# EAGLE design VGA32_V3 (EAGLE 6.3)
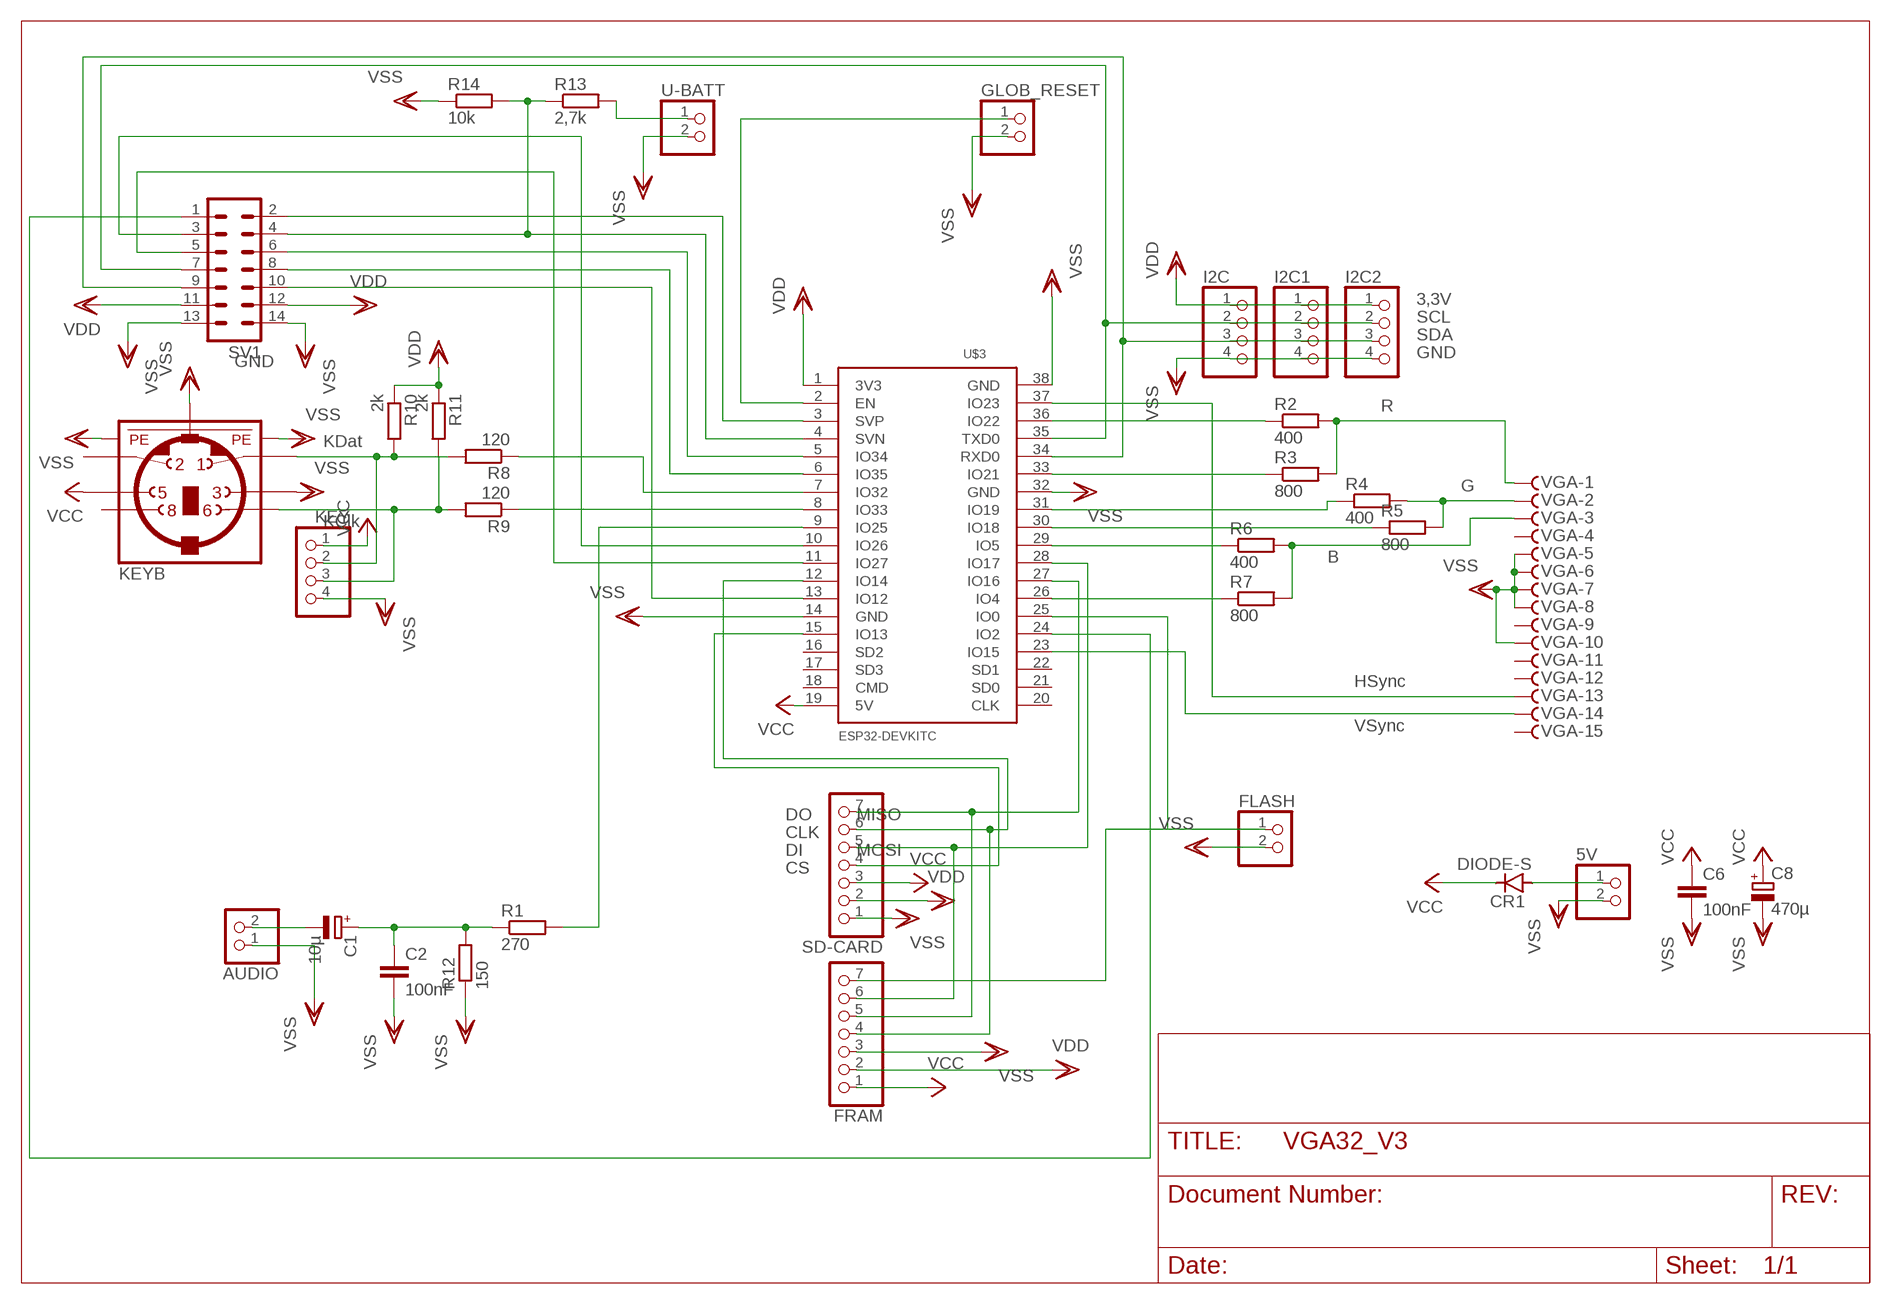
[diagram p0: schematic, sheet 1]

## Parts
5V  PINHD-1X2  [1X02]
AUDIO  PINHD-1X2  [1X02]
C1  10µ  CPOL-EUE2-4  [E2-4]
C2  100nF  C-EU025-030X050  [C025-030X050]
C6  100nF  C-EU025-030X050  [C025-030X050]
C8  470µ  CPOL-EUE3.5-10  [E3,5-10]
CR1  DIODE-S  [DO35-10]
FLASH  PINHD-1X2  [1X02]
FRAM  PINHD-1X7  [1X07]
GLOB_RESET  PINHD-1X2  [1X02]
I2C  PINHD-1X4  [1X04]
I2C1  PINHD-1X4  [1X04]
I2C2  PINHD-1X4  [1X04]
KEY  PINHD-1X4  [1X04]
KEYB  MINI_DIN_6  [M_DIN6]
R1  270  R-EU_0204/7  [0204/7]
R2  400  R-EU_0204/7  [0204/7]
R3  800  R-EU_0204/7  [0204/7]
R4  400  R-EU_0204/7  [0204/7]
R5  800  R-EU_0204/7  [0204/7]
R6  400  R-EU_0204/7  [0204/7]
R7  800  R-EU_0204/7  [0204/7]
R8  120  R-EU_0204/7  [0204/7]
R9  120  R-EU_0204/7  [0204/7]
R10  2k  R-EU_0204/7  [0204/7]
R11  2k  R-EU_0204/7  [0204/7]
R12  150  R-EU_0204/7  [0204/7]
R13  2,7k  R-EU_0204/7  [0204/7]
R14  10k  R-EU_0204/7  [0204/7]
SD-CARD  PINHD-1X7  [1X07]
SV1  ML14L  [ML14L]
U$3  ESP32DEVKITC  [ESP32-DEVKITC]
U-BATT  PINHD-1X2  [1X02]
VGA  F15HDHS  [HDF15H]

## Nets
5V [Power]: 5V.1 CR1.A
FLASH: FLASH.1 FRAM.7 U$3.25(IO0)
IO2: SV1.1 U$3.24(IO2)
IO12: SV1.10 U$3.13(IO12)
IO26: SV1.3 U$3.10(IO26)
IO27: SV1.5 U$3.11(IO27)
IO34: SV1.6 U$3.5(IO34)
IO35: SV1.8 U$3.6(IO35)
IO36: SV1.2 U$3.3(SVP)
IO39: R13.1 R14.2 SV1.4 U$3.4(SVN)
N$1: R1.2 U$3.9(IO25)
N$5: R13.2 U-BATT.1
N$12: C1.+ C2.1 R1.1 R12.2
N$14: AUDIO.2 C1.-
N$41: R6.2 R7.2 VGA.3
N$42: R4.2 R5.2 VGA.2
N$43: R2.2 R3.2 VGA.1
N$44: R2.1 U$3.36(IO22)
N$45: R3.1 U$3.33(IO21)
N$46: R4.1 U$3.31(IO19)
N$47: R5.1 U$3.30(IO18)
N$48: R6.1 U$3.29(IO5)
N$49: R7.1 U$3.26(IO4)
N$50: U$3.37(IO23) VGA.13
N$51: U$3.23(IO15) VGA.14
N$69: FRAM.5 SD-CARD.7 U$3.27(IO16)
N$70: FRAM.4 SD-CARD.6 U$3.12(IO14)
N$71: FRAM.6 SD-CARD.5 U$3.28(IO17)
N$72: SD-CARD.4 U$3.15(IO13)
N$75: KEY.2 KEYB.1 R8.2 R10.2
N$76: R8.1 U$3.7(IO32)
N$77: KEY.3 KEYB.6 R9.2 R11.2
N$78: R9.1 U$3.8(IO33)
RESET: GLOB_RESET.1 U$3.2(EN)
SCL: I2C1.2 I2C2.2 I2C.2 SV1.7 U$3.35(TXD0)
SDA: I2C1.3 I2C2.3 I2C.3 SV1.9 U$3.34(RXD0)
VCC [Power]: C6.1 C8.+ CR1.C FRAM.1 KEY.1 KEYB.5 SD-CARD.3 U$3.19(5V)
VDD [Power]: FRAM.2 I2C1.1 I2C2.1 I2C.1 R10.1 R11.1 SD-CARD.2 SV1.11 SV1.12 U$3.1(3V3)
VSS [Power]: 5V.2 AUDIO.1 C2.2 C6.2 C8.- FLASH.2 FRAM.3 GLOB_RESET.2 I2C1.4 I2C2.4 I2C.4 KEY.4 KEYB.3 KEYB.SH1(PE1) KEYB.SH2(PE2) KEYB.SH3(PE3) R12.1 R14.1 SD-CARD.1 SV1.13 SV1.14 U$3.14(GND) U$3.32(GND) U$3.38(GND) U-BATT.2 VGA.5 VGA.6 VGA.7 VGA.8 VGA.10
Unconnected: KEYB.2 KEYB.8 U$3.16(SD2) U$3.17(SD3) U$3.18(CMD) U$3.20(CLK) U$3.21(SD0) U$3.22(SD1) VGA.4 VGA.9 VGA.11 VGA.12 VGA.15

## Notes on the sheet
- 3,3V
- SCL
- SDA
- GND
- GND
- R
- KDat
- G
- KClk
- B
- HSync
- VSync
- DO | MISO
- CLK
- DI | MOSI
- CS

## Library data of the parts
5V AUDIO FLASH GLOB_RESET U-BATT = pinhead:PINHD-1X2: PIN HEADER
C1 C8 = rcl:CPOL-EU: POLARIZED CAPACITOR, European symbol
C2 C6 = rcl:C-EU: CAPACITOR, European symbol
CR1 = 0RB_Passive:DIODE-S: DIODE high speed (Philips)
FRAM SD-CARD = pinhead:PINHD-1X7: PIN HEADER
I2C I2C1 I2C2 KEY = pinhead:PINHD-1X4: PIN HEADER
KEYB = mini_din:MINI_DIN_6
R1-R14 = rcl:R-EU_: RESISTOR, European symbol
SV1 = con-ml:ML14L: HARTING; OC_FARNELL: unknown; OC_NEWARK: unknown
U$3 = ESP32-DEVKITC:ESP32DEVKITC
VGA = con-subd:F15?S: SUB-D; OC_FARNELL: unknown; OC_NEWARK: unknown

## Net classes
0 default: width 0.254 mm, clearance 0.254 mm
1 Power: width 0.635 mm, drill 0.61 mm, clearance 0.381 mm

## Board
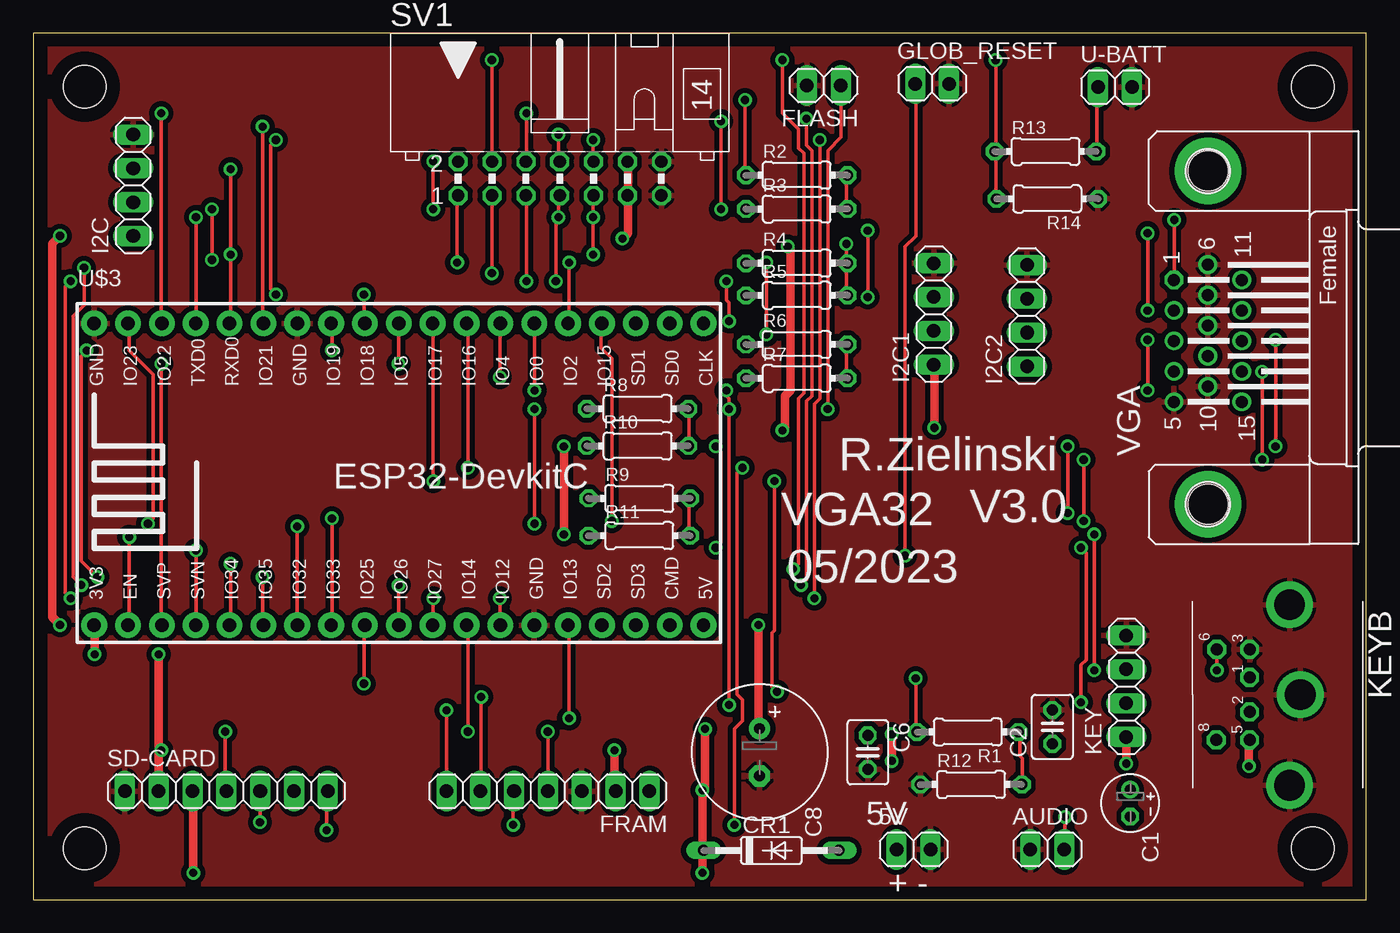
[diagram p1: board, top side]
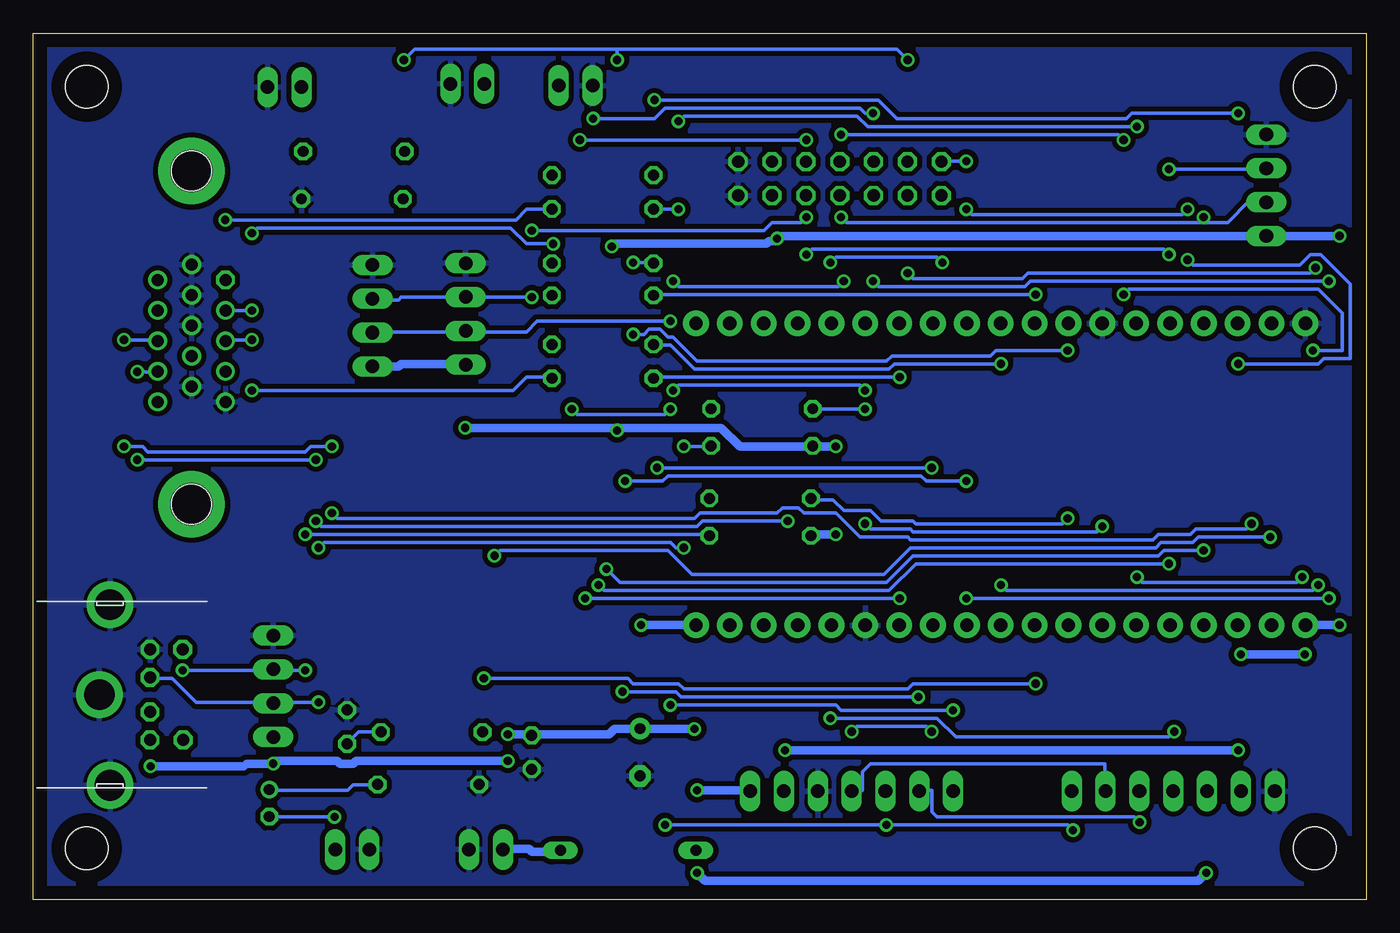
[diagram p2: board, bottom side, seen from below]

Size 100 x 65 mm. Coordinates in mm from the lower left corner, seen from the top.
Outline: 0,0 100,0 100,65 0,65 0,0
Copper layers (1*16): Top 0.035mm / dielectric 1.5mm / Bottom 0.035mm
Design rules "default": minimum track width 10mil, minimum drill 24mil, track to track 8mil, track to pad 8mil, pad to pad 8mil, via to via 8mil, smd to smd 8mil, copper to edge 40mil, drill to drill 8mil, minimum pad ring 10mil, minimum via ring 8mil, stop-mask expansion 4mil, vias tented up to drill 0mil, thermal gap 10mil
Holes 3.2 mm at 3.85,61 96,61 96,3.85 3.85,3.85

### Footprints (pad centres in the part's own frame; a part is rotated, then mirrored left to right if it is on the bottom)
1X02 = drill 1.016 long: 1 -1.27,0; 2 1.27,0
E2-4 = drill 0.813 pad 1.27: + -1.016,0 | drill 0.813 pad 1.27 octagon: - 1.016,0
C025-030X050 = drill 0.813 octagon: 1 -1.27,0; 2 1.27,0
E3,5-10 = drill 0.813 pad 1.6: + -1.778,0 | drill 0.813 pad 1.6 octagon: - 1.778,0
DO35-10 = drill 0.813 long: A 5.08,0; C -5.08,0
1X07 = drill 1.016 long: 1 -7.62,0; 2 -5.08,0; 3 -2.54,0; 4 0,0; 5 2.54,0; 6 5.08,0; 7 7.62,0
1X04 = drill 1.016 long: 1 -3.81,0; 2 -1.27,0; 3 1.27,0; 4 3.81,0
M_DIN6 = drill 0.9 pad 1.422 octagon: 1 -1.3,-3.75; 2 1.3,-3.75; 3 -3.4,-3.75; 5 3.4,-3.75; 6 -3.4,-6.2; 8 3.4,-6.25 | drill 2.3 pad 3.5: SH1 6.8,-0.75; SH2 0,0.05; SH3 -6.75,-0.75
0204/7 = drill 0.813 octagon: 1 -3.81,0; 2 3.81,0
ML14L = drill 0.914 octagon: 1 -7.62,-1.27; 2 -7.62,1.27; 3 -5.08,-1.27; 4 -5.08,1.27; 5 -2.54,-1.27; 6 -2.54,1.27; 7 0,-1.27; 8 0,1.27; 9 2.54,-1.27; 10 2.54,1.27; 11 5.08,-1.27; 12 5.08,1.27; 13 7.62,-1.27; 14 7.62,1.27
ESP32-DEVKITC = drill 1 pad 1.93: 1 -22.87,-11.42; 2 -20.33,-11.42; 3 -17.79,-11.42; 4 -15.25,-11.42; 5 -12.71,-11.42; 6 -10.17,-11.42; 7 -7.63,-11.42; 8 -5.09,-11.42; 9 -2.55,-11.42; 10 -0.01,-11.42; 11 2.53,-11.42; 12 5.07,-11.42; 13 7.61,-11.42; 14 10.15,-11.42; 15 12.69,-11.42; 16 15.23,-11.42; 17 17.77,-11.42; 18 20.31,-11.42; 19 22.85,-11.42; 20 22.85,11.23; 21 20.31,11.23; 22 17.77,11.23; 23 15.23,11.23; 24 12.69,11.23; 25 10.15,11.23; 26 7.61,11.23; 27 5.07,11.23; 28 2.53,11.23; 29 -0.01,11.23; 30 -2.55,11.23; 31 -5.09,11.23; 32 -7.63,11.23; 33 -10.17,11.23; 34 -12.71,11.23; 35 -15.25,11.23; 36 -17.79,11.23; 37 -20.33,11.23; 38 -22.87,11.23
HDF15H = drill 0.9 octagon: 1 4.329,2.54 | drill 0.9: 2 2.043,2.54; 3 -0.243,2.54; 4 -2.529,2.54; 5 -4.815,2.54; 6 5.472,0; 7 3.186,0; 8 0.9,0; 9 -1.386,0; 10 -3.672,0; 11 4.329,-2.54; 12 2.043,-2.54; 13 -0.243,-2.54; 14 -2.529,-2.54; 15 -4.815,-2.54 | drill 3.2 pad 5: VSS -12.5,0; VSS1 12.5,0 | hole 3: -12.5,0; 12.5,0

### Placement (x,y rotation side)
5V  66.04,3.76 0 top
AUDIO  76.07,3.76 0 top
C1  82.3,7.24 270 top
C2  76.45,12.95 90 top
C6  62.61,11.05 270 top
C8  54.48,11.05 270 top
CR1  55.37,3.68 0 top
FLASH  59.31,61.09 180 top
FRAM  38.61,8.13 180 top
GLOB_RESET  67.44,61.21 0 top
I2C  7.49,53.59 90 top
I2C1  67.56,43.94 90 top
I2C2  74.55,43.81 90 top
KEY  82,16 90 top
KEYB  95,15.37 270 top
R1  70.1,12.57 180 top
R2  57.28,54.36 0 top
R3  57.28,51.82 0 top
R4  57.28,47.75 0 top
R5  57.28,45.34 0 top
R6  57.28,41.66 0 top
R7  57.28,39.12 0 top
R8  45.34,36.83 0 top
R9  45.47,30.1 0 top
R10  45.34,34.04 0 top
R11  45.47,27.3 0 top
R12  70.36,8.64 0 top
R13  75.95,56.13 0 top
R14  76.07,52.58 180 top
SD-CARD  14.48,8.13 0 top
SV1  39.5,54.1 0 top
U$3  27.43,32 0 top
U-BATT  81.15,60.96 0 top
VGA  88.13,42.16 90 top

### Tracks (layer width: path | path; a pad name or v marks a point on that pad's centre or on a via)
5V
  Bottom 0.635: CR1.A 60.6,3.6 62.6,3.6 62.8,3.8 64.6,3.8 5V.1
FLASH  (via drill 0.61)
  Top 0.254: v31,14.2 31,8.2 FRAM.7 | v52.2,14.6 v52.2,36.8 52.2,37.6 52,37.8 v52,38.2 | v37.6,38.2 37.6,43.2 U$3.25 | v59.6,36.8 59.6,56.2 60.6,57.2 60.6,61 FLASH.1
  Bottom 0.254: v31,14.2 39.4,14.2 39.8,14.6 v52.2,14.6 | v52,38.2 51.6,38.6 38,38.6 v37.6,38.2 | v59.6,36.8 59.2,36.4 52.6,36.4 v52.2,36.8
IO2  (via drill 0.61)
  Top 0.254: v31.8,47.8 31.8,52.8 SV1.1 | v40.2,47.8 40.2,43.4 U$3.24
  Bottom 0.254: v31.8,47.8 32.2,48.2 39.8,48.2 v40.2,47.8
IO12  (via drill 0.61)
  Top 0.254: v42,57 42,55.4 SV1.10 | v59,57 59,37.6 58.6,37.2 v58.6,22.6 | v35,22.6 35,20.6 U$3.13
  Bottom 0.254: v59,57 v42,57 | v35,22.6 v58.6,22.6
IO26  (via drill 0.61)
  Top 0.254: v34.4,47 34.4,52.8 SV1.3 | v3.8,47.4 3.8,44.6 3,43.8 3,24.2 v3.6,23.6 | v27.4,23.6 27.4,20.6 U$3.10
  Bottom 0.254: v34.4,47 34,46.6 25.8,46.6 25.4,47 4.2,47 v3.8,47.4 | v3.6,23.6 4,23.2 27,23.2 v27.4,23.6
IO27  (via drill 0.61)
  Top 0.254: v37,46.4 37,52.8 SV1.5 | v2.8,46.4 2.4,46 2.4,23 v2.8,22.6 | v30,22.6 30,20.6 U$3.11
  Bottom 0.254: v37,46.4 36.6,46 25.6,46 25.2,46.4 v2.8,46.4 | v30,22.6 v2.8,22.6
IO34  (via drill 0.61)
  Top 0.254: v37,59 37,55.4 SV1.6 | v58,58.6 58,56.6 58.4,56.2 58.4,37.8 58,37.4 58,24 v57.6,23.6 | v14.8,25.2 14.8,20.6 U$3.5
  Bottom 0.254: v37,59 37.6,59 38,59.4 52.6,59.4 53.4,58.6 v58,58.6 | v57.6,23.6 57.2,23.2 35.8,23.2 33.8,25.2 v14.8,25.2
IO35  (via drill 0.61)
  Top 0.254: v39.4,57.4 39.4,55.4 SV1.8 | v18.2,57 17.8,56.6 17.8,45.8 v18.2,45.4 | v4,41.2 3.6,40.8 3.6,25.4 v4.8,24.2 | v17.2,24.2 17.2,20.6 U$3.6
  Bottom 0.254: v39.4,57.4 18.6,57.4 v18.2,57 | v18.2,45.4 17.8,45.8 3.6,45.8 1.8,44 1.8,41.2 v4,41.2 | v4.8,24.2 5.2,23.8 16.8,23.8 v17.2,24.2
IO36  (via drill 0.61)
  Top 0.254: v30,51.8 v30,55.4 | v13.4,48 v13.4,51.8 | v9.6,40.2 9.6,20.6 U$3.3
  Bottom 0.254: v30,55.4 31.8,55.4 SV1.2 | v30,51.8 29.6,51.4 13.8,51.4 v13.4,51.8 | v13.4,48 13,47.6 5,47.6 4.2,48.4 3.4,48.4 1.2,46.2 1.2,40.6 3.2,40.6 3.6,40.2 v9.6,40.2
IO39  (via drill 0.61)
  Top 0.254: R14.2 72.2,52.6 72.2,56 R13.1 72.2,56.2 v72.2,63 | v34.4,63 34.4,55.4 SV1.4 | v12.2,26.2 12.2,20.6 U$3.4 | v57,24.8 57.4,25.2 57.4,37.6 57.8,38 57.8,56 57.4,56.4 57.4,57.8 56.2,59 v56.2,63
  Bottom 0.254: v34.4,63 35.2,63.8 56.2,63.8 | 56.2,63.8 71.4,63.8 v72.2,63 | v12.2,26.2 15.2,26.2 15.6,25.8 34,25.8 36,23.8 56,23.8 v57,24.8 | 56.2,63.8 v56.2,63
N$1  (via drill 0.61)
  Top 0.254: v66.2,16.6 66.2,12.6 R1.2 | v24.8,16.2 24.8,20.4 U$3.9
  Bottom 0.254: v66.2,16.6 55.4,16.6 55,16.2 51.6,16.2 51.2,15.8 34.4,15.8 34,16.2 v24.8,16.2
N$5
  Top 0.254: R13.2 79.8,56.2 79.8,60.8 U-BATT.1
N$12
  Top 0.254: R12.2 74.2,8.8 74.2,10.6 74,10.8 74,12.4 R1.1
  Bottom 0.254: C2.1 76.4,11.8 75.6,12.6 74,12.6 R1.1 | C1.+ 82.2,8.2 76.4,8.2 76,8.6 74.2,8.6 R12.2
N$14  (via drill 0.61)
  Top 0.254: v77.4,6.2 77.4,3.8 AUDIO.2
  Bottom 0.254: v77.4,6.2 82.2,6.2 C1.-
N$41  (via drill 0.61)
  Top 0.254: R7.2 61,39.2 61,41.6 R6.2 | v83.6,38.2 v83.6,42
  Bottom 0.254: v83.6,42 85.4,42 VGA.3 | v83.6,38.2 64,38.2 63,39.2 61.2,39.2 R7.2
N$42  (via drill 0.61)
  Top 0.254: R5.2 61,45.4 61,47.6 R4.2 61,47.8 v61,49.2 | v83.6,50 v83.6,44.2
  Bottom 0.254: v83.6,44.2 85.4,44.2 VGA.2 | v83.6,50 83.2,50.4 64.2,50.4 63,49.2 v61,49.2
N$43  (via drill 0.61)
  Top 0.254: R3.2 61,52 61,54.2 R2.2 | v85.6,51 85.6,46.6 VGA.1
  Bottom 0.254: v85.6,51 63.8,51 63,51.8 61.2,51.8 R3.2
N$44  (via drill 0.61)
  Top 0.254: v53.4,60 53.4,54.4 R2.1 | v9.6,59 9.6,43.4 U$3.36
  Bottom 0.254: v53.4,60 36.6,60 35.2,58.6 18,58.6 17.6,59 v9.6,59
N$45  (via drill 0.61)
  Top 0.254: v51.6,58.4 v51.6,51.8 | v17.2,58 17.2,43.4 U$3.33
  Bottom 0.254: v51.6,51.8 53.4,51.8 R3.1 | v51.6,58.4 51.2,58.8 38.2,58.8 37.4,58 v17.2,58
N$46  (via drill 0.61)
  Top 0.254: v55,42.4 v55,47.8 | v22.4,41.2 22.4,43.2 U$3.31
  Bottom 0.254: v55,47.8 53.6,47.8 R4.1 | v55,42.4 54.2,42.4 53.8,42.8 53,42.8 52.4,42.2 52,42.2 50.2,40.4 36,40.4 35.6,40.8 28.2,40.8 27.8,41.2 v22.4,41.2
N$47  (via drill 0.61)
  Top 0.254: v24.8,45.4 24.8,43.4 U$3.30
  Bottom 0.254: v24.8,45.4 53.4,45.4 R5.1
N$48  (via drill 0.61)
  Top 0.254: v27.4,40.2 27.4,43.2 U$3.29
  Bottom 0.254: v27.4,40.2 35.4,40.2 35.8,39.8 50.4,39.8 52.2,41.6 53.4,41.6 R6.1
N$49  (via drill 0.61)
  Top 0.254: v35,39.2 35,43.2 U$3.26
  Bottom 0.254: v35,39.2 53.4,39.2 R7.1
N$50  (via drill 0.61)
  Top 0.254: v93.2,34 v93.2,42 | v77.6,29 v77.6,34 | v8.6,28.2 9,28.6 9,39.4 7.2,41.2 7.2,43.2 U$3.37
  Bottom 0.254: v93.2,42 90.8,42 VGA.13 | v93.2,34 91.8,34 91.4,33.6 79.6,33.6 79.2,34 v77.6,34 | v77.6,29 77.2,28.6 50.4,28.6 50,29 44.2,29 43.8,29.4 42.6,29.4 42.2,29 39.8,29 38,27.2 34.4,27.2 34.2,27 16,27 15.6,27.4 13.2,27.4 12.8,27.8 9,27.8 v8.6,28.2
N$51  (via drill 0.61)
  Top 0.254: v92.2,33 v92.2,39.6 | v78.8,28.4 v78.8,33 | v43.4,28.4 43.4,40.6 42.6,41.4 42.6,43.2 U$3.23
  Bottom 0.254: v92.2,39.6 90.8,39.6 VGA.14 | v78.8,33 v92.2,33 | v78.8,28.4 78.4,28 50.2,28 49.8,28.4 v43.4,28.4
N$69  (via drill 0.61)
  Top 0.254: v22,5.2 22,8 SD-CARD.7 | v36,5.6 36,8 FRAM.5 | v32.6,32.4 32.6,43.2 U$3.27 | v53.2,32.4 52.8,32 52.8,15.4 53.2,15 53.2,13.4 52.6,12.8 v52.6,5.6
  Bottom 0.254: v22,5.2 22.4,5.6 v36,5.6 v52.6,5.6 | v53.2,32.4 v32.6,32.4
N$70  (via drill 0.61)
  Top 0.254: v32.6,12.6 32.6,20.4 U$3.12 | v38.6,12.6 38.6,8.2 FRAM.4
  Bottom 0.254: SD-CARD.6 19.6,8.2 19.6,10.2 37.2,10.2 37.8,9.6 37.8,8.2 38.6,8.2 FRAM.4 | v32.6,12.6 33,13 38.2,13 v38.6,12.6
N$71  (via drill 0.61)
  Top 0.254: v17,5.8 17,8 SD-CARD.5 | v30,31.4 30,43.2 U$3.28 | v55.6,31.4 55.6,20.2 55.4,20 55.4,16 v55.8,15.6 | v33.6,15.2 33.6,8.2 FRAM.6
  Bottom 0.254: v17,5.8 17.4,6.2 32.2,6.2 32.6,6.6 32.6,8.2 33.4,8.2 FRAM.6 | v30,31.4 33,31.4 33.4,31.8 52.4,31.8 52.8,31.4 v55.6,31.4 | v55.8,15.6 51.8,15.6 51.4,15.2 v33.6,15.2
N$72  (via drill 0.61)
  Top 0.254: v14.4,12.6 14.4,8.2 SD-CARD.4 | v40.2,13.6 40.2,20.4 U$3.15
  Bottom 0.254: v14.4,12.6 14.8,12.2 30.8,12.2 32.2,13.6 v40.2,13.6
N$75  (via drill 0.61)
  Top 0.254: R10.2 49.2,34.2 49.2,36.8 R8.2 | v51.2,34 51.6,33.6 51.6,26.8 v51.2,26.4 | v78.6,26.4 79,26 79,18 78.6,17.6 v78.6,14.8
  Bottom 0.254: 82,14.8 87.8,14.8 89.6,16.6 91.2,16.6 KEYB.1 | v51.2,34 49.2,34 R10.2 | v51.2,26.4 51.8,26.4 52.2,26.8 78.2,26.8 v78.6,26.4 | 82,14.8 v78.6,14.8 | 82,14.8 KEY.2
N$76  (via drill 0.61)
  Top 0.254: v37.6,28.2 v37.6,36.8 | v19.8,28 19.8,20.6 U$3.7
  Bottom 0.254: v37.6,36.8 41.4,36.8 R8.1 | v37.6,28.2 37.2,27.8 34.2,27.8 34,27.6 20.2,27.6 v19.8,28
N$77  (via drill 0.61)
  Top 0.254: R11.2 49.2,27.4 49.2,30 R9.2 | v88.8,17.2 KEYB.6 | v79.6,17.2 v79.6,27.4
  Bottom 0.254: 82,17.2 v88.8,17.2 | v79.6,27.4 49.4,27.4 R11.2 | 82,17.2 v79.6,17.2 | 82,17.2 KEY.3
N$78  (via drill 0.61)
  Top 0.254: v22.4,28.6 22.4,20.6 U$3.8
  Bottom 0.254: v22.4,28.6 22.8,28.2 33.8,28.2 34,28.4 36.4,28.4 37.2,29.2 39.2,29.2 40,30 41.6,30 R9.1
RESET  (via drill 0.61)
  Top 0.254: v65.4,25.8 65.4,49 66.2,49.8 66.2,61.2 GLOB_RESET.1 | v7.2,27.2 7.2,20.6 U$3.2
  Bottom 0.254: v65.4,25.8 65,26.2 52.4,26.2 50.6,24.4 36.2,24.4 34.2,26.4 15.8,26.4 15.4,26.8 13,26.8 12.6,27.2 v7.2,27.2
SCL  (via drill 0.61)
  Top 0.254: SV1.7 39.4,52.8 v39.4,51.2 39.4,51 39.2,50.8 v39.2,46.4 | v12.2,51.2 12.2,43.4 U$3.35 | v52.2,43.4 52.2,44.8 52,45 v52,46.4
  Bottom 0.254: I2C2.2 74.4,42.6 67.6,42.6 I2C1.2 67.4,42.6 63,42.6 62.2,43.4 v52.2,43.4 | v39.4,51.2 39,50.8 12.2,50.8 | 12.2,50.8 10.4,50.8 8.8,52.4 7.6,52.4 I2C.2 | 12.2,50.8 v12.2,51.2 | v52,46.4 51.6,46 39.6,46 v39.2,46.4
SDA  (via drill 0.61)
  Top 0.254: v42,48.4 v42,51.2 42,52.8 SV1.9 | U$3.34 14.8,43.4 v14.8,48.4 v14.8,54.8 | v62.6,50.2 v62.6,45.2
  Bottom 0.254: I2C2.3 74.4,45 72.6,45 72.4,45.2 67.6,45.2 I2C1.3 67.4,45.2 v62.6,45.2 | v42,48.4 41.6,48.8 15.2,48.8 v14.8,48.4 | v14.8,54.8 7.6,54.8 I2C.3 | v62.6,50.2 45.2,50.2 44.6,50.8 42.4,50.8 v42,51.2
VCC  (via drill 0.61)
  Top 0.635: v12,2 12,8 SD-CARD.3 | v50.2,2 50.2,3.4 CR1.C 50.2,3.8 v50.2,8.2 50.4,8.4 v50.4,12.8 | v91.2,10 91.2,11.8 KEYB.5 | KEY.1 v82,10.2 | v54.4,20.6 54.4,13 C8.+ | v64.4,12.4 v64.4,10.4
  Bottom 0.635: v50.2,8.2 46.4,8.2 FRAM.1 | v12,2 12.6,1.4 49.6,1.4 v50.2,2 | v91.2,10 84.2,10 84,10.2 v82,10.2 81.8,10.4 77.2,10.4 77,10.2 76,10.2 75.8,10.4 v64.4,10.4 | v54.4,20.6 50.4,20.6 U$3.19 | v64.4,12.4 62.8,12.4 C6.1 62.6,12.4 56.8,12.4 56.4,12.8 54.6,12.8 C8.+ 54.2,12.8 v50.4,12.8
VDD  (via drill 0.61)
  Top 0.635: v39.8,34 v39.8,27.4 | v67.6,35.4 67.6,40 I2C1.1 | SV1.12 44.6,55.2 44.6,53 SV1.11 44.6,52.6 44.6,50 v44.2,49.6 | v9.4,18.4 9.4,11.2 | 9.4,11.2 9.4,8.2 SD-CARD.2 | v4.6,18.4 4.6,20.4 U$3.1 | v43.6,11.2 43.6,8.2 FRAM.2 | v9.6,11.2 9.4,11.2 | v2,49.8 1.4,49.2 1.4,21.2 v2,20.6 | v56.2,35.2 56.4,35.4 56.4,37.8 56.8,38.2 56.8,48.8 v56.6,49
  Bottom 0.635: v39.8,27.4 41.6,27.4 R11.1 | v39.8,34 41.4,34 R10.1 41.8,34 47,34 48.4,35.4 56.2,35.4 | I2C1.1 67.6,40.2 72.4,40.2 72.6,40 74.4,40 I2C2.1 | v67.6,35.4 56.2,35.4 | v4.6,18.4 v9.4,18.4 | v9.6,11.2 v43.6,11.2 | v2,49.8 7.2,49.8 I2C.1 7.6,49.8 44,49.8 v44.2,49.6 44.4,49.4 44.8,49.4 45,49.2 56.4,49.2 v56.6,49 | v2,20.6 4.4,20.6 U$3.1 | v56.2,35.2 56.2,35.4
VSS
  pour Top: 1.27,64.52 99,64.52 98.87,0.89 1.14,0.89
  pour Bottom: 1.27,64.52 99,64.52 99,0.76 1.27,0.76

### Text on the board
tNames: R.Zielinski | VGA32 | V3.0 | 05/2023 | 5V | + -